# Altium schematic sheet PCA_0006_Mini_CB_Servo_REV_B.SchDoc
size A4; DrawnBy: Philip Rowse
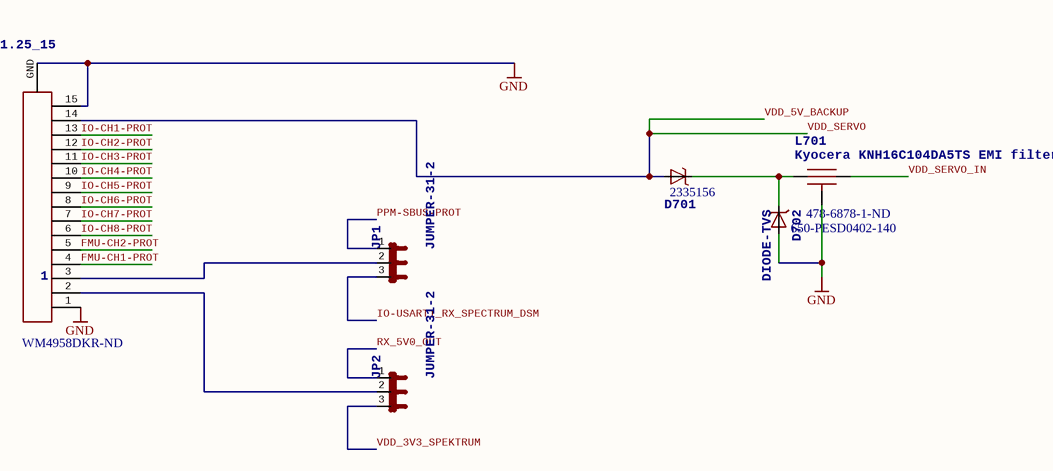
[diagram p0: PCA_0006_Mini_CB_Servo_REV_B.SchDoc]

## Parts
1  CLICKMATE_1.25_15  Supplier Part Number 1: WM4958DKR-ND  [CLICKMATE_H15]
D701  Supplier Part Number 1: 2335156  [MICROSMP]  (hidden comment: Schottky barrier diode in DO214AC, e.g. Fairchild SS14.)
D702  DIODE-TVS  Supplier Part Number 1: 650-PESD0402-140  [0402-TVS]
JP1  JUMPER-31-2  [SJ_3_PASTE1&2]
JP2  JUMPER-31-2  [SJ_3_PASTE1&2]
L701  Kyocera KNH16C104DA5TS EMI filter  Supplier Part Number 1: 478-6878-1-ND  [KYOCERA-KNH16-DA]

## Nets
GND: 1.1 1.15 1.GND D702.A L701.GND
FMU-CH1-PROT: 1.4
FMU-CH2-PROT: 1.5
IO-CH1-PROT: 1.13
IO-CH2-PROT: 1.12
IO-CH3-PROT: 1.11
IO-CH4-PROT: 1.10
IO-CH5-PROT: 1.9
IO-CH6-PROT: 1.8
IO-CH7-PROT: 1.7
IO-CH8-PROT: 1.6
IO-USART1_RX_SPECTRUM_DSM: JP1.3
PPM-SBUS-PROT: JP1.1
RX_5V0_OUT: JP2.1
VDD_3V3_SPEKTRUM: JP2.3
VDD_5V_BACKUP: 1.14 D701.ANODE(A)  [also labelled VDD_SERVO]
VDD_SERVO_IN: L701.P$2
Net1_2: 1.2 JP2.2
Net1_3: 1.3 JP1.2
NetD701_CATHODE: D701.CATHODE(C) D702.C L701.P$1

## Notes on the sheet
- This licence Applies to this doccument ONLY, other components that make up the full system come with their own licences, please check with the Author for further information
- To the extent possible under law, Philip Rowse and 3DRobotics has waived all copyright and related or neighboring
- rights to Carrier board for APM 3.0 series. This work is published from: United States, and Australia
- Title:
- Date:
- Time:
- For information on this Licence: http://creativecommons.org/publicdomain/zero/1.0/
- Sheet:
- Approved:
- of:
- Drawn By:
- Checked By:
- 3DRobotics

## Library data of the parts
1 = CLICKMATE_1.25_15: Connector, Receptacle, 15Pos, 1.25MM, R/A, SMD, Tin; 3DR_PARTNO: ECM0530; Supplier 1: Digi-Key
D701 = DIODE-SCHOTTKY_MSMP: Diode, Schottky, 40V, 1A, MicroSMP, SMD; partnumber: MSS1P4-M3/89A; 3DR_PARTNO: ECM0900; man: vishay; Supplier 1: Farnell
D702 = DIODE-TVS: Diode, TVS, 14VWM, 40VC, 0402, SMD; 3DR_PARTNO: ECM0837; Supplier 1: Mouser
JP1 JP2 = JUMPER-31-2: DO NOT FIT
L701 = KNH16C104DA5TS: Capacitor, Filter, 0.1uF, 25V, 2A, 0603, SMD; 3DR_PARTNO: ECM0719; Supplier 1: Digi-Key